# EAGLE design i2cbus (EAGLE 5.10)
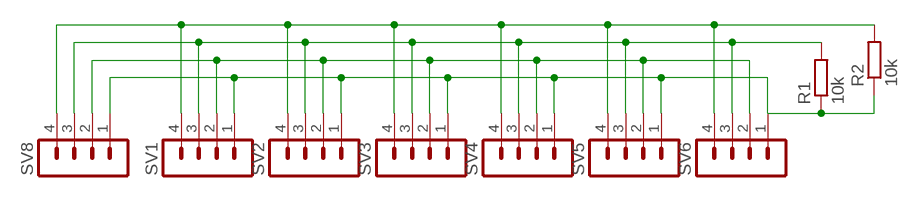
[diagram p0: schematic, sheet 1]

## Parts
R1  10k  R-EU_M0805  [M0805]
R2  10k  R-EU_M0805  [M0805]
SV1  MA04-1  [MA04-1]
SV2  MA04-1  [MA04-1]
SV3  MA04-1  [MA04-1]
SV4  MA04-1  [MA04-1]
SV5  MA04-1  [MA04-1]
SV6  MA04-1  [MA04-1]
SV8  MA04-1  [MA04-1]

## Nets
GND: SV1.2 SV2.2 SV3.2 SV4.2 SV5.2 SV6.2 SV8.2
N$1: R2.2 SV1.4 SV2.4 SV3.4 SV4.4 SV5.4 SV6.4 SV8.4
N$2: R1.2 SV1.3 SV2.3 SV3.3 SV4.3 SV5.3 SV6.3 SV8.3
VDD: R1.1 R2.1 SV1.1 SV2.1 SV3.1 SV4.1 SV5.1 SV6.1 SV8.1

## Library data of the parts
R1 R2 = rcl:R-EU_: RESISTOR, European symbol
SV1-SV6 SV8 = con-lstb:MA04-1: PIN HEADER

## Board
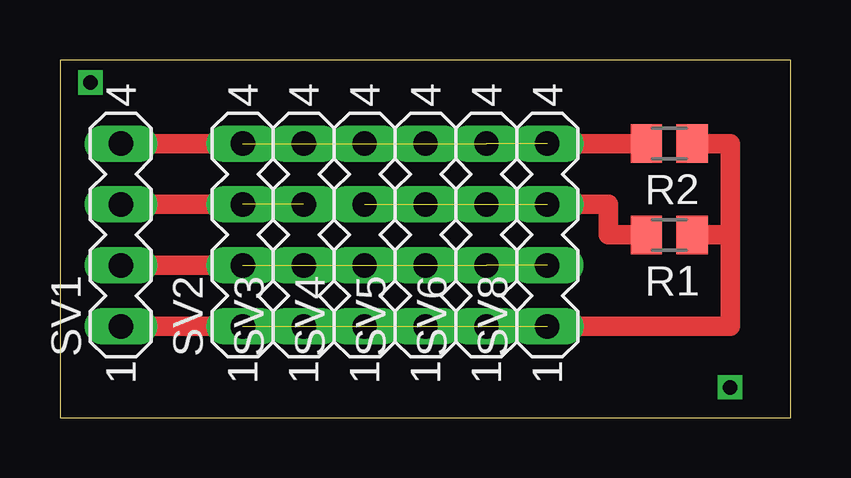
[diagram p1: board, top side]
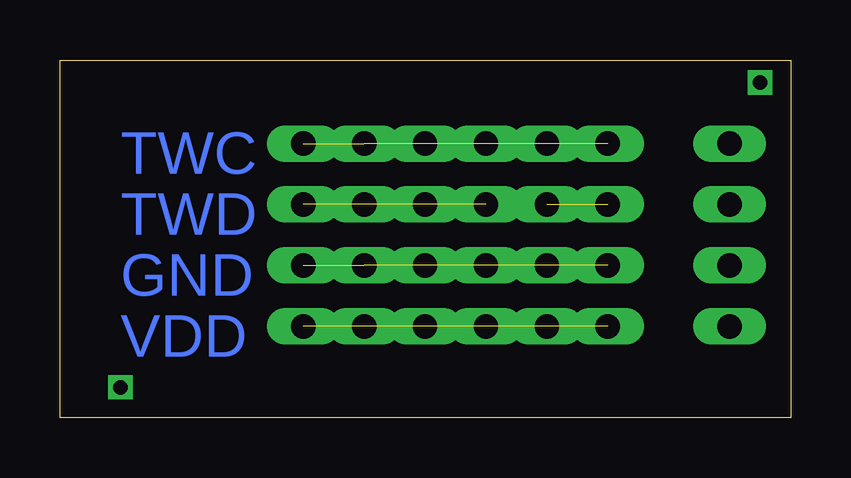
[diagram p2: board, bottom side, seen from below]

Size 30.46 x 14.91 mm. Coordinates in mm from the lower left corner, seen from the top.
Outline: 0,0 30.46,0 30.46,14.91 0,14.91 0,0
Copper layers (1*16): Top 0.035mm / dielectric 1.5mm / Bottom 0.035mm
Design rules "default": minimum track width 20mil, minimum drill 32mil, track to track 16mil, track to pad 16mil, pad to pad 16mil, via to via 16mil, smd to smd 12mil, copper to edge 40mil, drill to drill 40mil, minimum pad ring 10mil, minimum via ring 8mil, stop-mask expansion 4mil, vias tented up to drill 0mil, thermal gap 10mil

### Footprints (pad centres in the part's own frame; a part is rotated, then mirrored left to right if it is on the bottom)
M0805 = smd 1.3 x 1.6: 1 -0.95,0; 2 0.95,0
MA04-1 = drill 1.016 long: 1 -3.81,0; 2 -1.27,0; 3 1.27,0; 4 3.81,0

### Placement (x,y rotation side)
R1  25.4,7.62 180 top
R2  25.4,11.43 180 top
SV1  2.54,7.62 90 top
SV2  7.62,7.62 90 top
SV3  10.16,7.62 90 top
SV4  12.7,7.62 90 top
SV5  15.24,7.62 90 top
SV6  17.78,7.62 90 top
SV8  20.32,7.62 90 top

### Tracks (layer width: path | path; a pad name or v marks a point on that pad's centre or on a via)
GND  (5 unrouted)
  Top 0.813: SV1.2 SV8.2
N$1  (5 unrouted)
  Top 0.813: SV1.4 SV8.4 R2.2
N$2  (4 unrouted)
  Top 0.813: SV1.3 SV2.3 SV8.3 22.86,8.89 22.86,7.62 R1.2
N$3  (via drill 0.6)
  other vias: 1.27,13.97
N$4  (via drill 0.6)
  other vias: 27.94,1.27
VDD  (5 unrouted)
  Top 0.813: SV1.1 SV8.1 27.94,3.81 27.94,7.62 | R2.1 27.94,11.43 27.94,7.62 | R1.1 27.94,7.62

### Text on the board
Bottom: TWC | TWD | GND | VDD